# Altium project RS485.PrjPcb
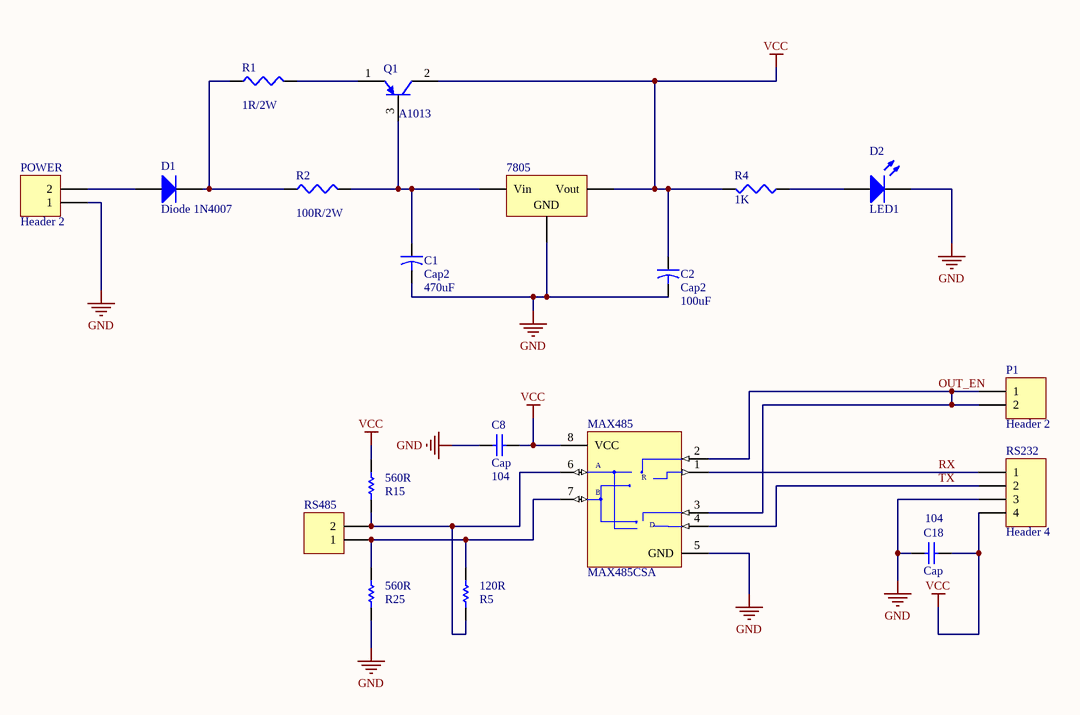
[diagram p0: RS485.SchDoc]
1 sheet, 19 parts. Net scope: global (net labels, ports and power ports of the same name join across sheets).
Board file: RS485.PcbDoc

## Sheet RS485.SchDoc
size A

### Parts
7805  Volt Reg  [78xx_NO]  (value not drawn)
C1  Cap2  value 470uF  [tu 10uF]
C2  Cap2  value 100uF  [tu 10uF]
C8  Cap  value 104  [tu_gom]
C18  Cap  value 104  [tu_gom]
D1  Diode 1N4007  [D_2A]
D2  LED1  [LED_3]
MAX485  MAX485CSA  [PA8]
P1  Header 2  [HDR1X2]
POWER  Header 2  [Header2 - duplicate]
Q1  A1013  [D468/A1013]
R1  value 1R/2W  [R_CS0R22/2W]  (hidden comment: Res3)
R2  value 100R/2W  [R_CS0R22/2W]  (hidden comment: Res3)
R4  value 1K  [R_Nor]  (hidden comment: Res3)
R5  120R  [R_Nor]
R15  560R  [R_Nor]
R25  560R  [R_Nor]
RS232  Header 4  [Header4]
RS485  Header 2  [Header2 - duplicate]  (value not drawn)

### Nets
GND: 7805.2(GND) C1.2 C2.2 C8.1 C18.1 D2.2(K) MAX485.5(GND) POWER.1 R25.1 RS232.3
VCC: 7805.3(Vout) C2.1 C8.2 C18.2 MAX485.8(VCC) Q1.2(C) R4.2 R15.2 RS232.4
OUT_EN: MAX485.2(~{RE}) MAX485.3(DE) P1.1 P1.2
RX: MAX485.1(RO) RS232.1
TX: MAX485.4(DI) RS232.2
Net7805_1: 7805.1(Vin) C1.1 Q1.3(B) R2.2
NetD1_1: D1.1(A) POWER.2
NetD1_2: D1.2(K) R1.1 R2.1
NetD2_1: D2.1(A) R4.1
NetMAX485_6: MAX485.6(A) R5.1 R15.1 RS485.2
NetMAX485_7: MAX485.7(B) R5.2 R25.2 RS485.1
NetQ1_1: Q1.1(E) R1.2

### Notes on the sheet
- (in symbol MAX485CSA) R; D

### Library data of the parts
7805 = Volt Reg: Voltage Regulator; Published: 24-Mar-1999; LatestRevisionDate: 17-Jul-2002; LatestRevisionNote: Re-released for DXP Platform.; PackageReference: D2PAK; Publisher: Altium Limited; Code_JEDEC: SMD-220
C1 C2 = Cap2: Capacitor; Published: 23-Sep-2002; PackageReference: CAPR5-4X5; Publisher: Altium Limited
C8 C18 = Ceramic: Capcitor
D1 = Diode 1N4007: 1 Amp General Purpose Rectifier; Published: 8-Jun-2000; LatestRevisionDate: 17-Jul-2002; LatestRevisionNote: Re-released for DXP Platform.; DatasheetVersion: 1998; PackageVersion: Aug-1999; PackageReference: DO-41; Publisher: Altium Limited; Code_JEDEC: DO-204-AL; ComponentLink1Description: Manufacturer Link; ComponentLink1URL: http://www.fairchildsemi.com/; ComponentLink2Description: Datasheet; ComponentLink2URL: http://www.fairchildsemi.com/ds/1N%2F1N4001.pdf
D2 = LED1: Typical RED GaAs LED; Published: 8-Jun-2000; LatestRevisionDate: 08-Jul-2005; LatestRevisionNote: Mech Layer 1 removed.; PackageReference: LED-1; Publisher: Altium Limited
MAX485 = MAX485CSA: Low-Power, Slew-Rate-Limited RS-485/RS-422 Transceiver; Published: 16-Jan-2001; LatestRevisionDate: 13-Apr-2006; LatestRevisionNote: IPC-7351 Footprint Added.; DatasheetVersion: Feb-1996; PackageReference: NSO8; Publisher: Altium Limited; PackageDescription: 8-Pin Small Outline Integrated Circuit 1.27 mm Pitch; Code_JEDEC: MS-012-AA; Code_IPC: SOIC127P600-8; ComponentLink1Description: Manufacturer Link; ComponentLink1URL: http://www.maxim-ic.com/; ComponentLink2Description: Datasheet; ComponentLink2URL: http://pdfserv.maxim-ic.com/en/ds/MAX1487-MAX491.pdf
P1 POWER RS485 = Header 2: Header, 2-Pin; LatestRevisionDate: 17-Jul-2002; LatestRevisionNote: Re-released for DXP Platform.; Publisher: Altium Limited
Q1 = PNP: PNP Bipolar Transistor; Published: 8-Jun-2000; LatestRevisionDate: 17-Jul-2002; LatestRevisionNote: Re-released for DXP Platform.; PackageReference: SOT-23B; Publisher: Altium Limited; Code_JEDEC: SOT-23
R1 R2 R4 = Res3: Resistor; Published: 8-Jun-2000; LatestRevisionDate: 04-Mar-2005; LatestRevisionNote: PCB Footprint replaced.; PackageReference: J1-0603; Publisher: Altium Limited
R5 R15 R25 = Res
RS232 = Header 4: Header, 4-Pin; LatestRevisionDate: 17-Jul-2002; LatestRevisionNote: Re-released for DXP Platform.; Publisher: Altium Limited